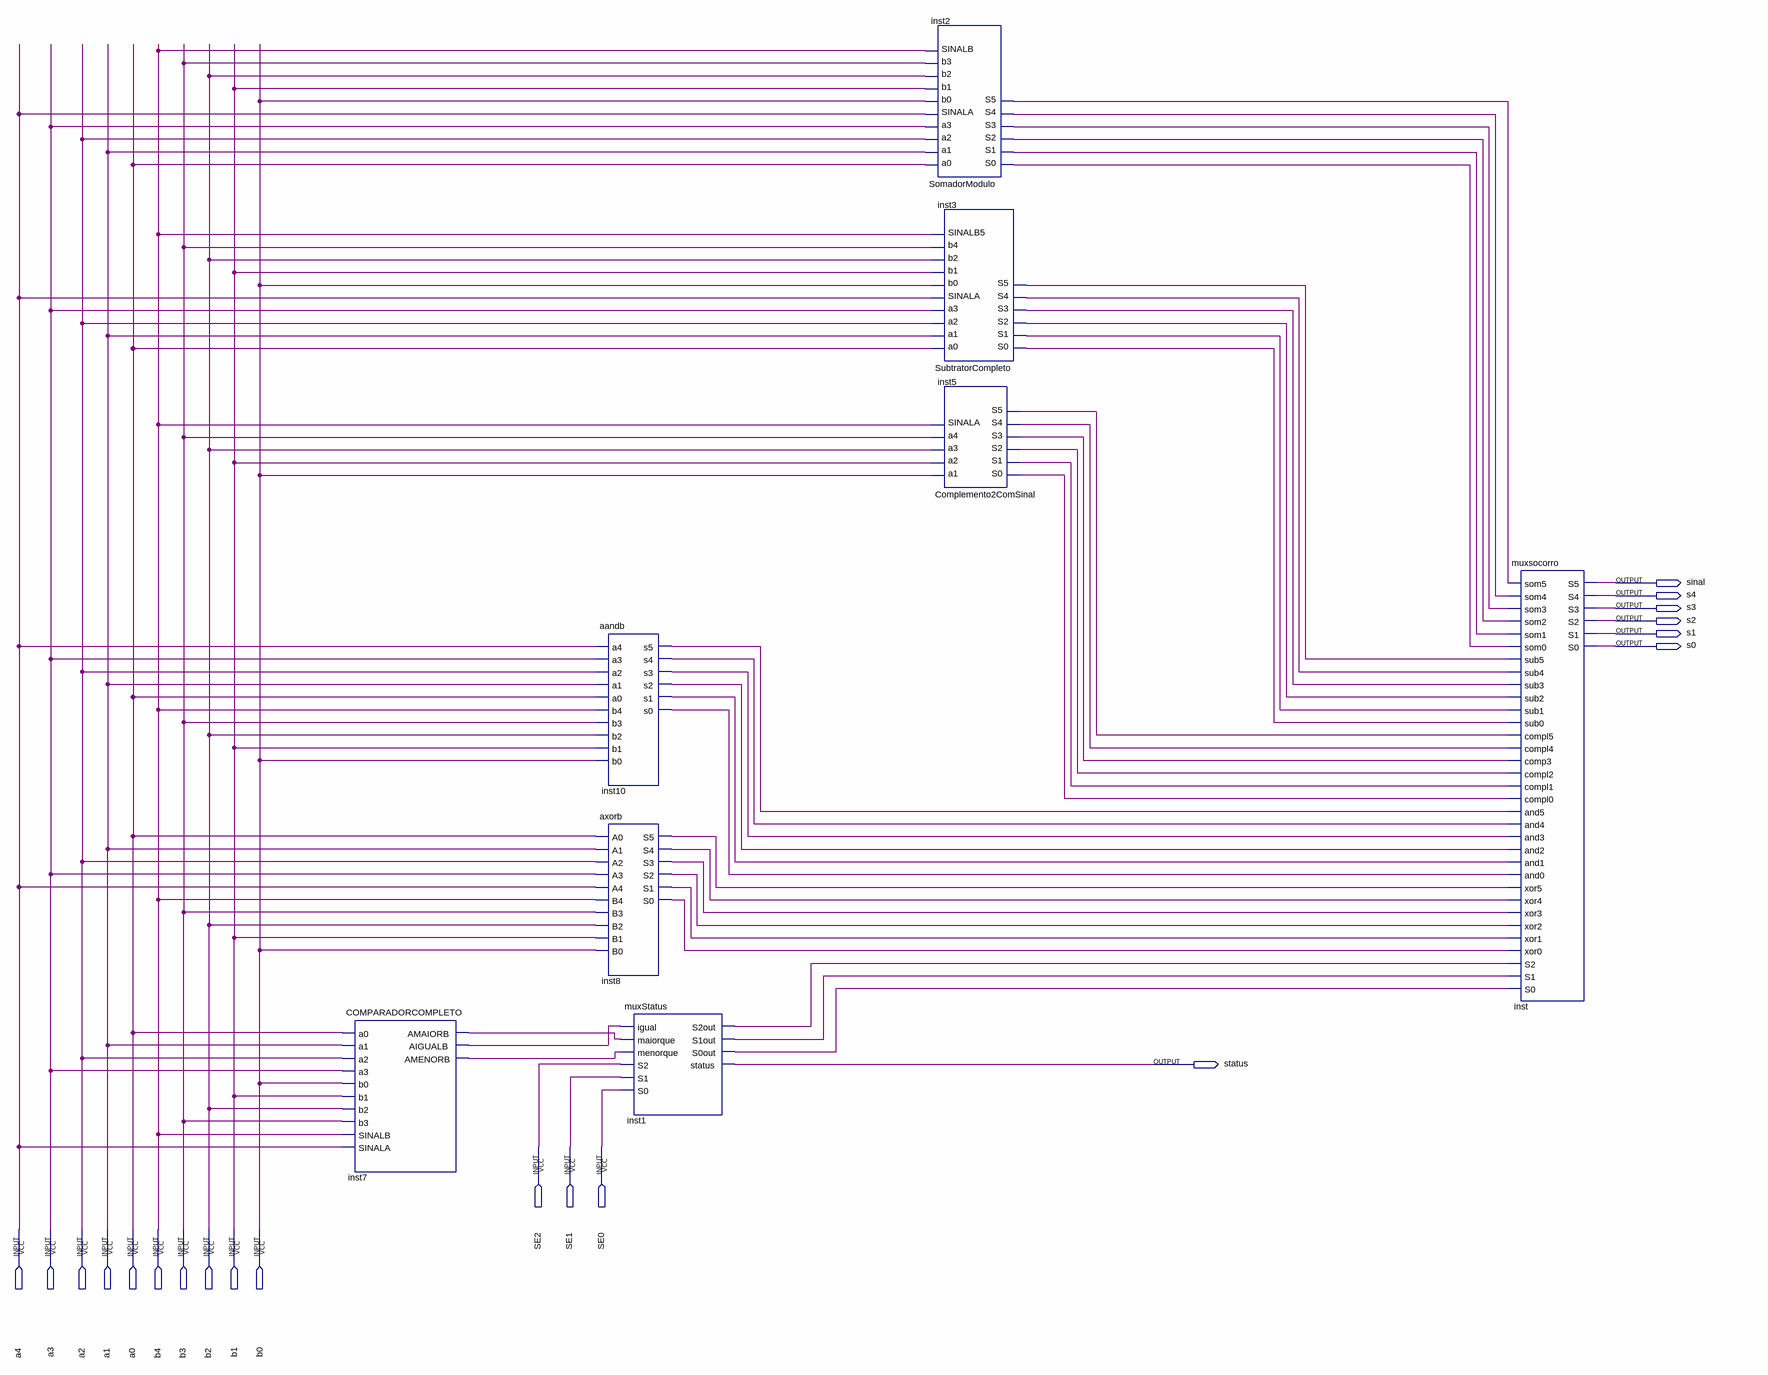
[diagram p0: schematic sheet]
// Quartus schematic juntandoProjeto.bdf as structural Verilog: 8 symbols, 20 pins
module juntandoProjeto (
  input  SE2,
  input  SE1,
  input  SE0,
  input  a4,
  input  a3,
  input  a2,
  input  a1,
  input  a0,
  input  b4,
  input  b3,
  input  b2,
  input  b1,
  input  b0,
  output sinal,
  output s4,
  output s3,
  output s2,
  output s1,
  output s0,
  output status
);

  wire inst1_s0out, inst1_s1out, inst1_s2out, inst2_s0, inst2_s1, inst2_s2, inst2_s3, inst2_s4, inst2_s5,
       inst3_s0, inst3_s1, inst3_s2, inst3_s3, inst3_s4, inst3_s5, inst5_s0, inst5_s1, inst5_s2, inst5_s3,
       inst5_s4, inst5_s5, inst7_aigualb, inst7_amaiorb, inst7_amenorb, inst8_s0, inst8_s1, inst8_s2,
       inst8_s3, inst8_s4, inst8_s5, inst10_s0, inst10_s1, inst10_s2, inst10_s3, inst10_s4, inst10_s5;

  COMPARADORCOMPLETO inst7 (
    .a0(a0), .a1(a1), .a2(a2), .a3(a3), .b0(b0), .b1(b1), .b2(b2), .b3(b3), .SINALB(b4), .SINALA(a4),
    .AMAIORB(inst7_amaiorb), .AIGUALB(inst7_aigualb), .AMENORB(inst7_amenorb));
  aandb inst10 (
    .a4(a4), .a3(a3), .a2(a2), .a1(a1), .a0(a0), .b4(b4), .b3(b3), .b2(b2), .b1(b1), .b0(b0), .s5(inst10_s5),
    .s4(inst10_s4), .s3(inst10_s3), .s2(inst10_s2), .s1(inst10_s1), .s0(inst10_s0));
  axorb inst8 (
    .A0(a0), .A1(a1), .A2(a2), .A3(a3), .A4(a4), .B4(b4), .B3(b3), .B2(b2), .B1(b1), .B0(b0), .S5(inst8_s5),
    .S4(inst8_s4), .S3(inst8_s3), .S2(inst8_s2), .S1(inst8_s1), .S0(inst8_s0));
  muxStatus inst1 (
    .igual(inst7_aigualb), .maiorque(inst7_amaiorb), .menorque(inst7_amenorb), .S2(SE2), .S1(SE1), .S0(SE0),
    .S2out(inst1_s2out), .S1out(inst1_s1out), .S0out(inst1_s0out), .status(status));
  SomadorModulo inst2 (
    .a0(a0), .a1(a1), .a2(a2), .a3(a3), .SINALA(a4), .b0(b0), .b1(b1), .b2(b2), .b3(b3), .SINALB(b4),
    .S0(inst2_s0), .S1(inst2_s1), .S2(inst2_s2), .S3(inst2_s3), .S4(inst2_s4), .S5(inst2_s5));
  SubtratorCompleto inst3 (
    .a0(a0), .a1(a1), .a2(a2), .a3(a3), .SINALA(a4), .b0(b0), .b1(b1), .b2(b2), .b4(b3), .SINALB5(b4),
    .S0(inst3_s0), .S1(inst3_s1), .S2(inst3_s2), .S3(inst3_s3), .S4(inst3_s4), .S5(inst3_s5));
  Complemento2ComSinal inst5 (
    .a1(b0), .a2(b1), .a3(b2), .a4(b3), .SINALA(b4), .S0(inst5_s0), .S1(inst5_s1), .S2(inst5_s2),
    .S3(inst5_s3), .S4(inst5_s4), .S5(inst5_s5));
  muxsocorro inst (
    .som5(inst2_s5), .som4(inst2_s4), .som3(inst2_s3), .som2(inst2_s2), .som1(inst2_s1), .som0(inst2_s0),
    .sub5(inst3_s5), .sub4(inst3_s4), .sub3(inst3_s3), .sub2(inst3_s2), .sub1(inst3_s1), .sub0(inst3_s0),
    .compl5(inst5_s5), .compl4(inst5_s4), .comp3(inst5_s3), .compl2(inst5_s2), .compl1(inst5_s1),
    .compl0(inst5_s0), .and5(inst10_s5), .and4(inst10_s4), .and3(inst10_s3), .and2(inst10_s2),
    .and1(inst10_s1), .and0(inst10_s0), .xor5(inst8_s5), .xor4(inst8_s4), .xor3(inst8_s3), .xor2(inst8_s2),
    .xor1(inst8_s1), .xor0(inst8_s0), .S2({inst1_s2out, s2}), .S1({inst1_s1out, s1}), .S0({inst1_s0out, s0}),
    .S5(sinal), .S4(s4), .S3(s3));
endmodule
